# EAGLE design RF-Gen_Controller (EAGLE 4.16)

## Sheet 1 of 4
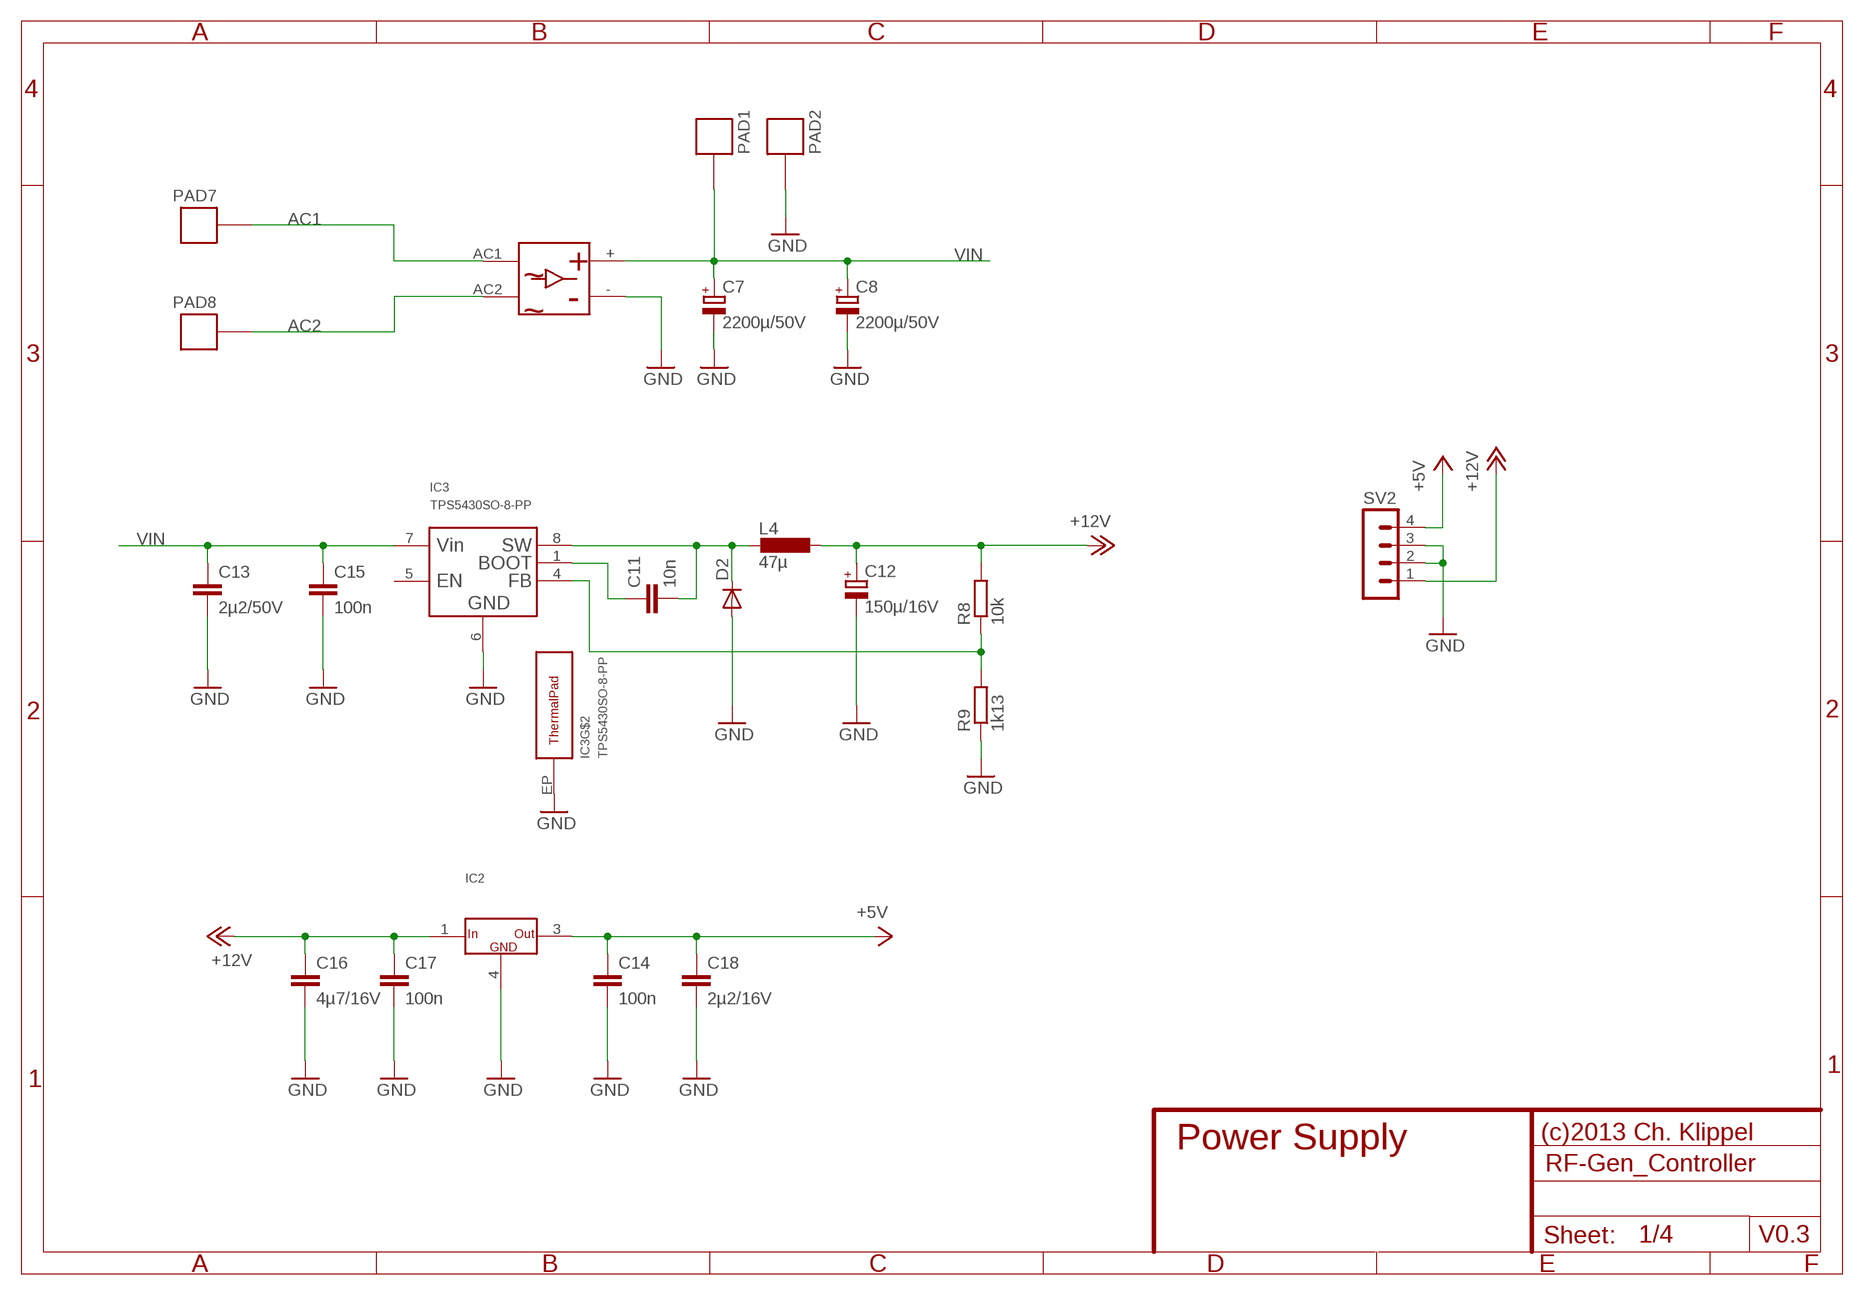
[diagram p0: schematic, sheet 1]

### Parts
BR1  RECTIFIERGBJ_THT  [GBJ_THT]
C7  2200µ/50V  C-POL-EU-EEUHD1H_VERT2  [CAP_EEUHD1H_VERT2]
C8  2200µ/50V  C-POL-EU-EEUHD1H_VERT2  [CAP_EEUHD1H_VERT2]
C11  10n  C-EU-1206  [C_1206_REFLOW]
C12  150µ/16V  C-POL-EU-AL_100_108  [CAP_AL_100_108]
C13  2µ2/50V  C-EU-1210  [C_1210_REFLOW]
C14  100n  C-EU-0805  [C_0805_REFLOW]
C15  100n  C-EU-0805  [C_0805_REFLOW]
C16  4µ7/16V  C-EU-1210  [C_1210_REFLOW]
C17  100n  C-EU-0805  [C_0805_REFLOW]
C18  2µ2/16V  C-EU-1210  [C_1210_REFLOW]
D2  DIODE-SMB  [SMB]
IC2  VREG_3DPAK-3  [DPAK-3]
IC3  TPS5430SO-8-PP  [SO-8-PP]
L4  47µ  L-EU-SSR1260  [SSR1260]
PAD1  SOLPAD5MM  [SOLPAD_5]
PAD2  SOLPAD5MM  [SOLPAD_5]
PAD7  SOLPAD5MM  [SOLPAD_5]
PAD8  SOLPAD5MM  [SOLPAD_5]
R8  10k  R-EU-0805  [R_0805_REFLOW]
R9  1k13  R-EU-0805  [R_0805_REFLOW]
SV2  MA04-1  [MA04-1]

### Nets
+5V: C14.P$1 C18.P$1 IC2.3(OUT) SV2.4 ; also sheet 2,3,4
+12V: C12.+ C16.P$1 C17.P$1 IC2.1(IN) L4.1 R8.P$2 SV2.1 ; also sheet 4
AC1: BR1.AC1 PAD7.P$1
AC2: BR1.AC2 PAD8.P$1
GND: BR1.- C7.- C8.- C12.- C13.P$2 C14.P$2 C15.P$2 C16.P$2 C17.P$2 C18.P$2 D2.A IC2.4(GND) IC3.6(GND) IC3.EP(THERMALPAD) PAD2.P$1 R9.P$1 SV2.2 SV2.3 ; also sheet 2,3,4
N$11: C11.P$1 IC3.1(BOOT)
N$13: IC3.4(FB) R8.P$1 R9.P$2
SW12: C11.P$2 D2.C IC3.8(SW) L4.2
VIN: BR1.+ C7.+ C8.+ C13.P$1 C15.P$1 IC3.7(VIN) PAD1.P$1 ; also sheet 4
Unconnected: IC3.5(EN)

### Notes on the sheet
- (c)2013 Ch. Klippel
- Power Supply
- V0.3

## Sheet 2 of 4
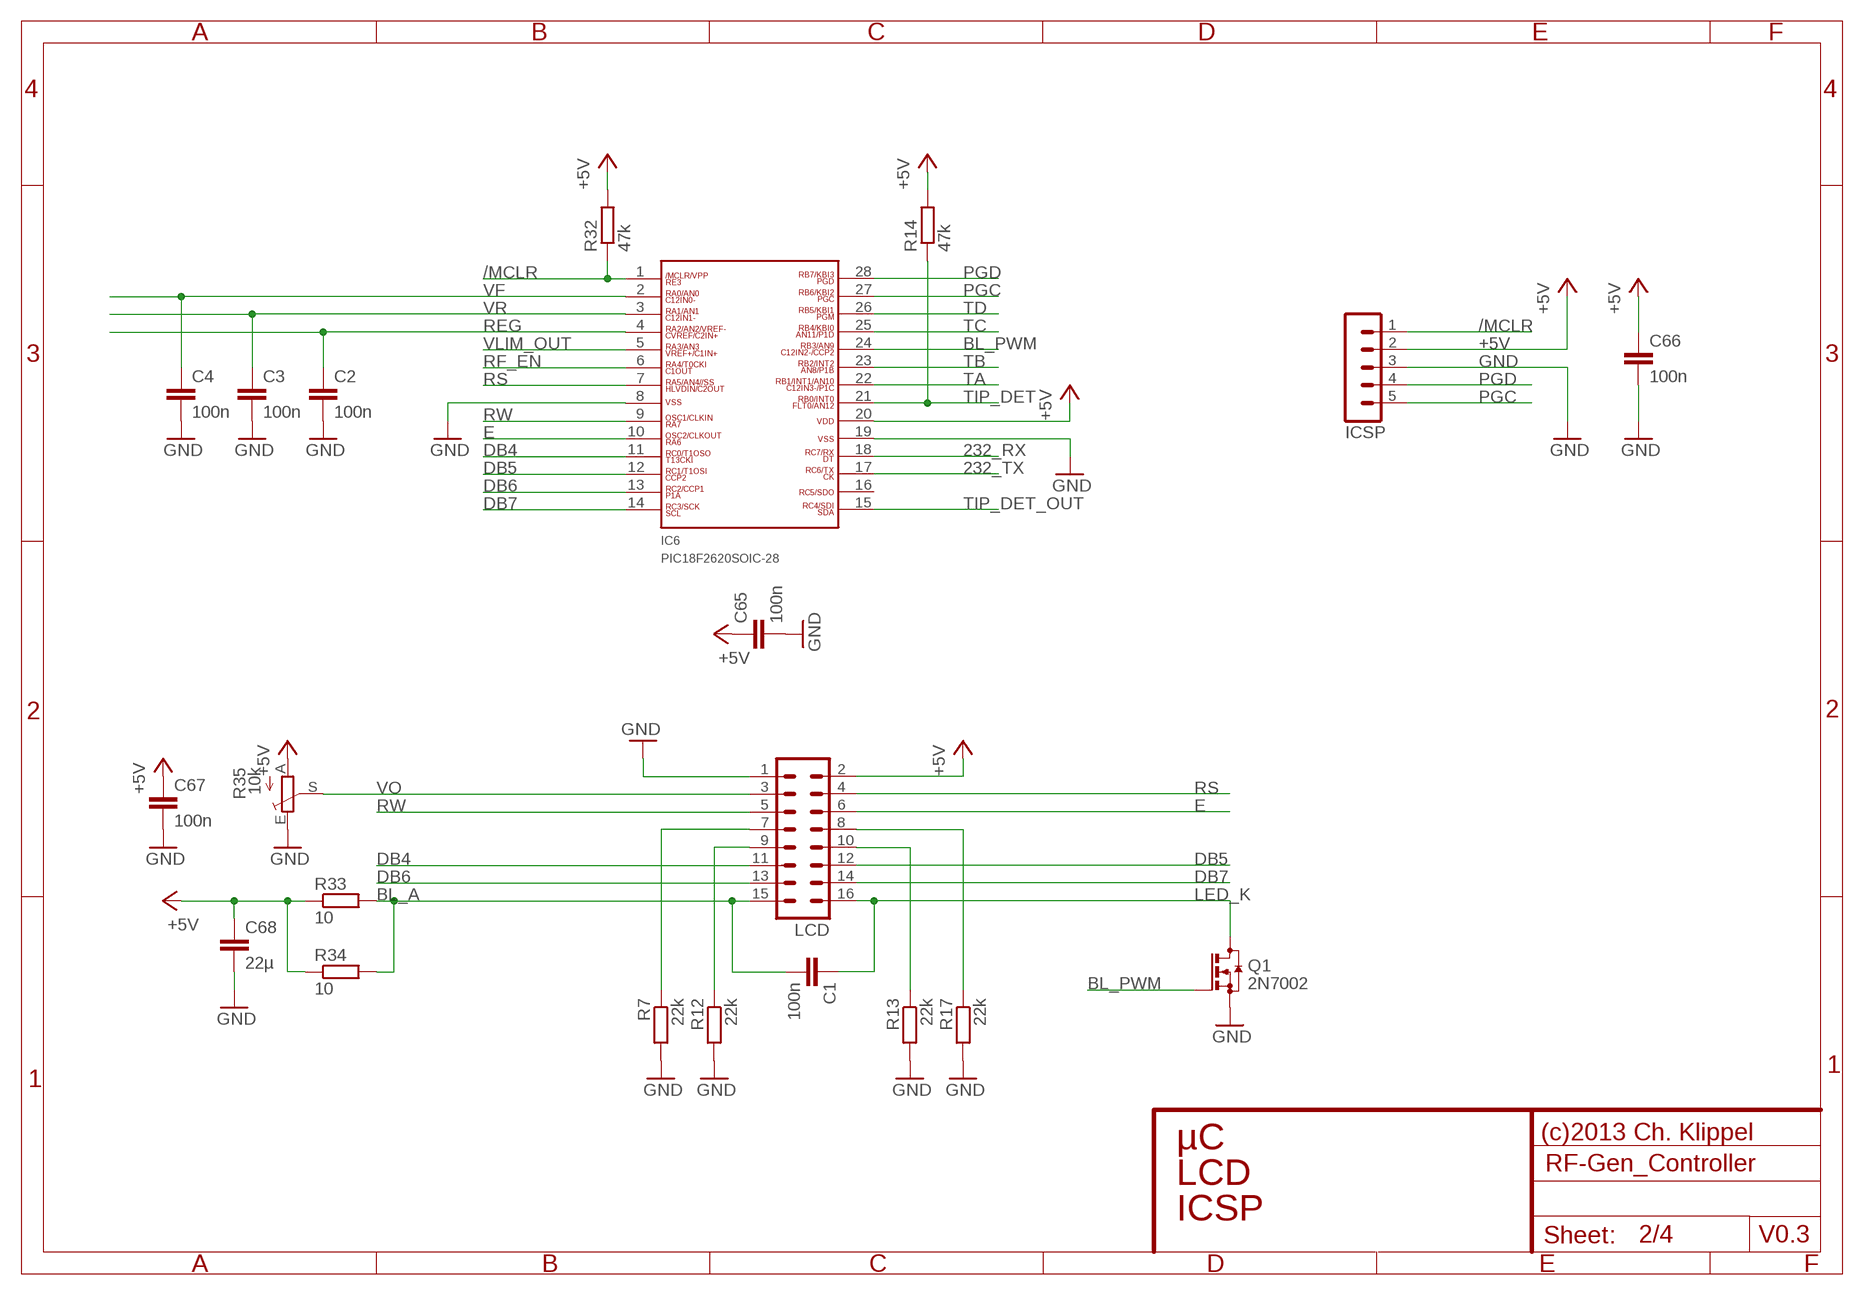
[diagram p1: schematic, sheet 2]

### Parts
C1  100n  C-EU-0805  [C_0805_REFLOW]
C2  100n  C-EU-0805  [C_0805_REFLOW]
C3  100n  C-EU-0805  [C_0805_REFLOW]
C4  100n  C-EU-0805  [C_0805_REFLOW]
C65  100n  C-EU-0805  [C_0805_REFLOW]
C66  100n  C-EU-0805  [C_0805_REFLOW]
C67  100n  C-EU-0805  [C_0805_REFLOW]
C68  22µ  C-EU-1206  [C_1206_REFLOW]
IC6  PIC18F2620SOIC-28  PIC18F26K20SOIC-28  [SOIC-28]
ICSP  MA05-1THT  [MA05-1]
LCD  ML16  [ML16]
Q1  2N7002  BSS123  [SOT23]
R7  22k  R-EU-0805  [R_0805_REFLOW]
R12  22k  R-EU-0805  [R_0805_REFLOW]
R13  22k  R-EU-0805  [R_0805_REFLOW]
R14  47k  R-EU-0805  [R_0805_REFLOW]
R17  22k  R-EU-0805  [R_0805_REFLOW]
R32  47k  R-EU-0805  [R_0805_REFLOW]
R33  10  R-EU-1206  [R_1206_REFLOW]
R34  10  R-EU-1206  [R_1206_REFLOW]
R35  10k  TRIM_EU-3364W  [3364W]

### Nets
232_RX: IC6.18 ; also sheet 3
232_TX: IC6.17 ; also sheet 3
+5V: C65.P$1 C66.P$1 C67.P$1 C68.P$1 IC6.20 ICSP.2 LCD.2 R14.P$2 R32.P$2 R33.P$1 R34.P$1 R35.A ; also sheet 1,3,4
/MCLR: IC6.1 ICSP.1 R32.P$1 ; also sheet 3
BL_A: C1.P$2 LCD.15 R33.P$2 R34.P$2
BL_PWM: IC6.24 Q1.1(G)
DB4: IC6.11 LCD.11
DB5: IC6.12 LCD.12
DB6: IC6.13 LCD.13
DB7: IC6.14 LCD.14
E: IC6.10 LCD.6
GND: C2.P$2 C3.P$2 C4.P$2 C65.P$2 C66.P$2 C67.P$2 C68.P$2 IC6.8 IC6.19 ICSP.3 LCD.1 Q1.2(S) R7.P$2 R12.P$2 R13.P$2 R17.P$2 R35.E ; also sheet 1,3,4
LED_K: C1.P$1 LCD.16 Q1.3(D)
N$3: LCD.9 R12.P$1
N$4: LCD.7 R7.P$1
N$5: LCD.10 R13.P$1
N$16: LCD.8 R17.P$1
PGC: IC6.27 ICSP.5
PGD: IC6.28 ICSP.4
REG: C2.P$1 IC6.4 ; also sheet 4
RF_EN: IC6.6 ; also sheet 4
RS: IC6.7 LCD.4
RW: IC6.9 LCD.5
TA: IC6.22 ; also sheet 3
TB: IC6.23 ; also sheet 3
TC: IC6.25 ; also sheet 3
TD: IC6.26 ; also sheet 3
TIP_DET: IC6.21 R14.P$1 ; also sheet 4
TIP_DET_OUT: IC6.15
VF: C4.P$1 IC6.2 ; also sheet 4
VLIM_OUT: IC6.5 ; also sheet 4
VO: LCD.3 R35.S
VR: C3.P$1 IC6.3 ; also sheet 4
Unconnected: IC6.16

### Notes on the sheet
- (c)2013 Ch. Klippel
- µC
- LCD
- ICSP
- V0.3

## Sheet 3 of 4
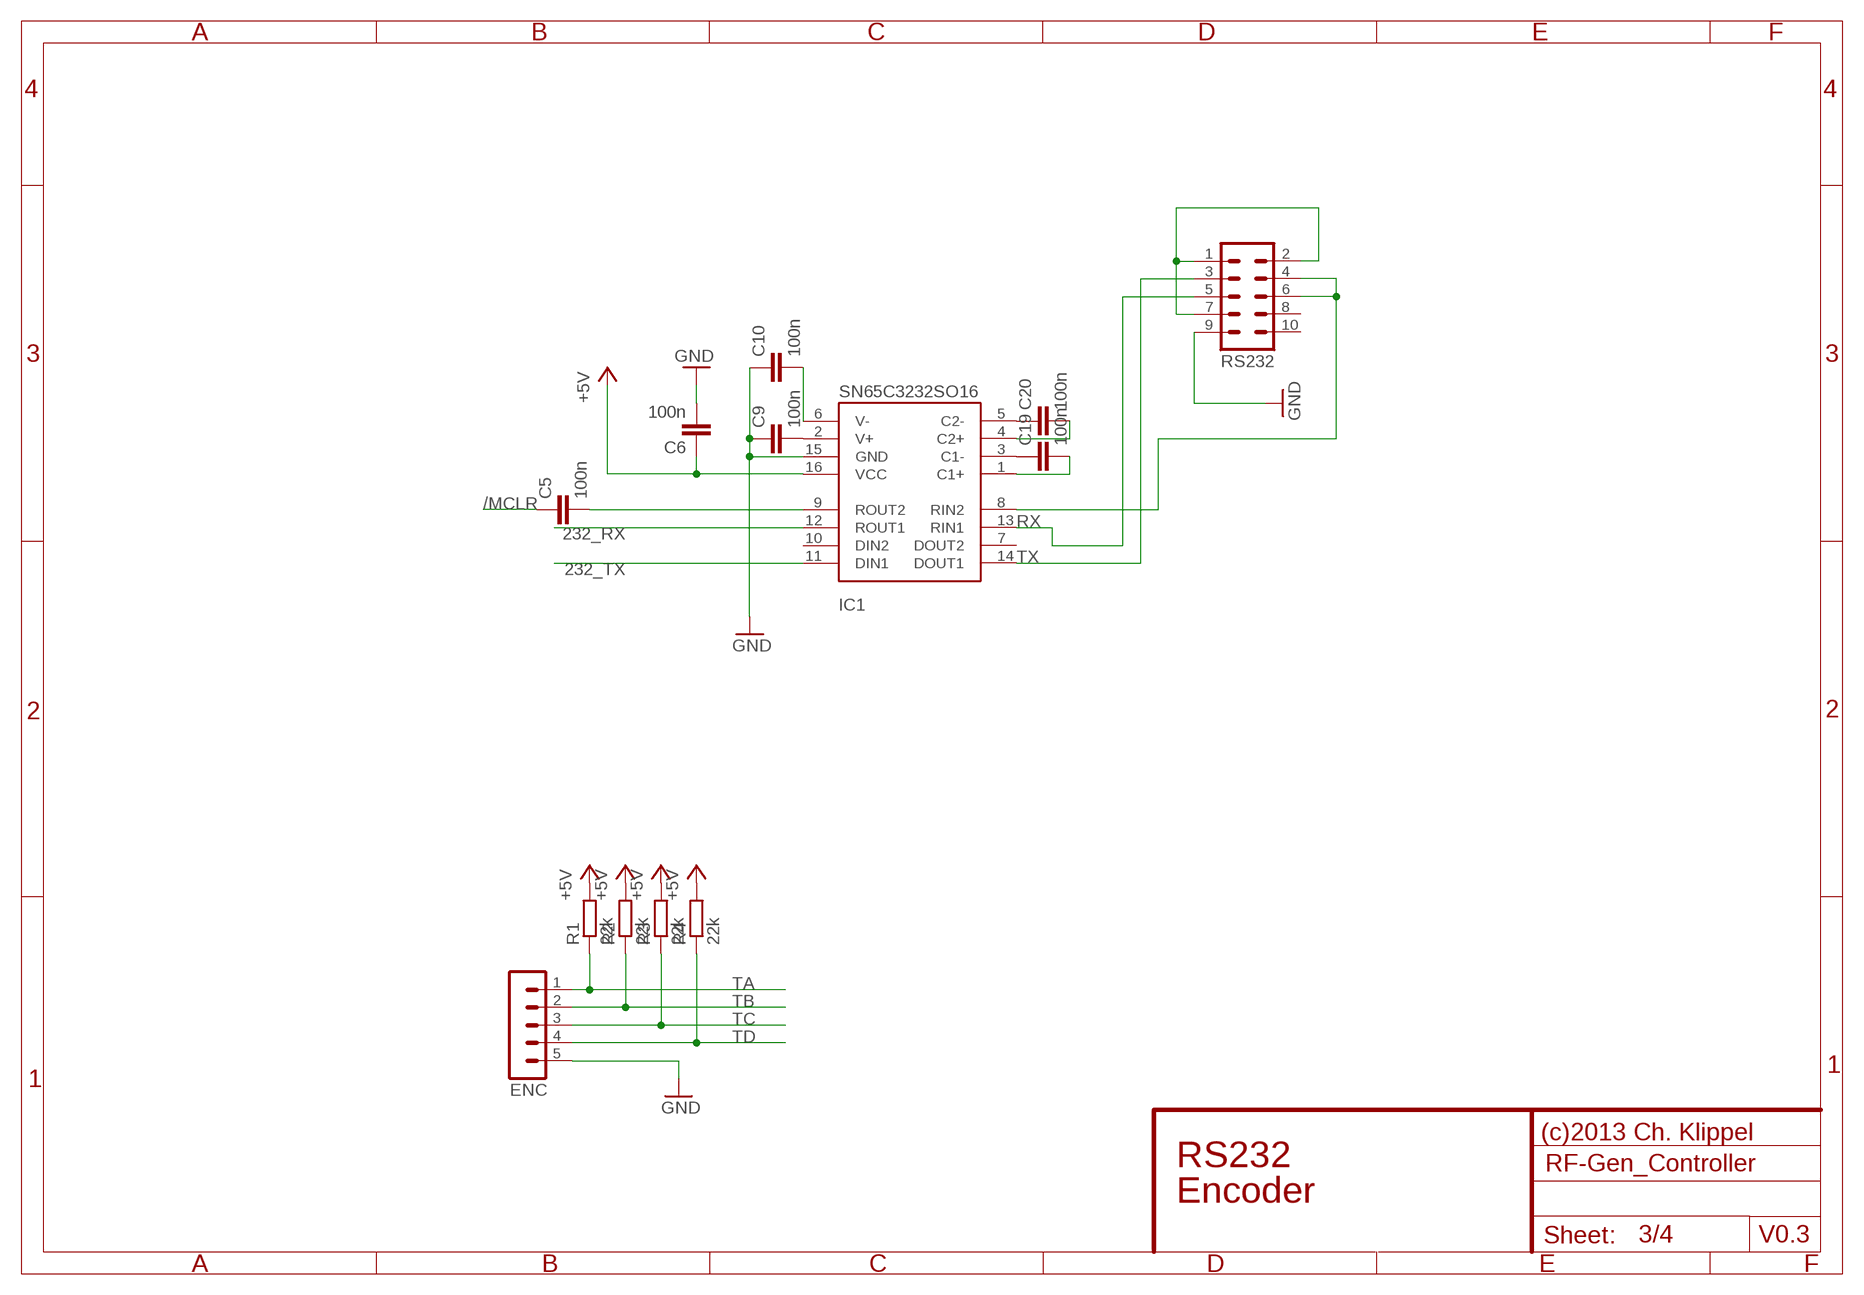
[diagram p2: schematic, sheet 3]

### Parts
C5  100n  C-EU-0805  [C_0805_REFLOW]
C6  100n  C-EU-0805  [C_0805_REFLOW]
C9  100n  C-EU-0805  [C_0805_REFLOW]
C10  100n  C-EU-0805  [C_0805_REFLOW]
C19  100n  C-EU-0805  [C_0805_REFLOW]
C20  100n  C-EU-0805  [C_0805_REFLOW]
ENC  MA05-1THT  [MA05-1]
IC1  SN65C3232SO16  [SO16]
R1  22k  R-EU-0805  [R_0805_REFLOW]
R2  22k  R-EU-0805  [R_0805_REFLOW]
R3  22k  R-EU-0805  [R_0805_REFLOW]
R4  22k  R-EU-0805  [R_0805_REFLOW]
RS232  ML10  [ML10]

### Nets
232_RX: IC1.12(ROUT1) ; also sheet 2
232_TX: IC1.11(DIN1) ; also sheet 2
+5V: C6.P$1 IC1.16(VCC) R1.P$2 R2.P$2 R3.P$2 R4.P$2 ; also sheet 1,2,4
/MCLR: C5.P$1 ; also sheet 2
DETECT: RS232.1 RS232.2 RS232.7
GND: C6.P$2 C9.P$1 C10.P$1 ENC.5 IC1.15(GND) RS232.9 ; also sheet 1,2,4
N$6: C9.P$2 IC1.2(V+)
N$8: C5.P$2 IC1.9(ROUT2)
N$9: C10.P$2 IC1.6(V-)
N$14: C19.P$1 IC1.3(C1-)
N$15: C20.P$1 IC1.5(C2-)
N$20: C20.P$2 IC1.4(C2+)
N$21: C19.P$2 IC1.1(C1+)
RX: IC1.13(RIN1) RS232.5
SRESET: IC1.8(RIN2) RS232.4 RS232.6
TA: ENC.1 R1.P$1 ; also sheet 2
TB: ENC.2 R2.P$1 ; also sheet 2
TC: ENC.3 R3.P$1 ; also sheet 2
TD: ENC.4 R4.P$1 ; also sheet 2
TX: IC1.14(DOUT1) RS232.3
Unconnected: IC1.7(DOUT2) IC1.10(DIN2) RS232.8 RS232.10

### Notes on the sheet
- (c)2013 Ch. Klippel
- RS232
- Encoder
- V0.3

## Sheet 4 of 4
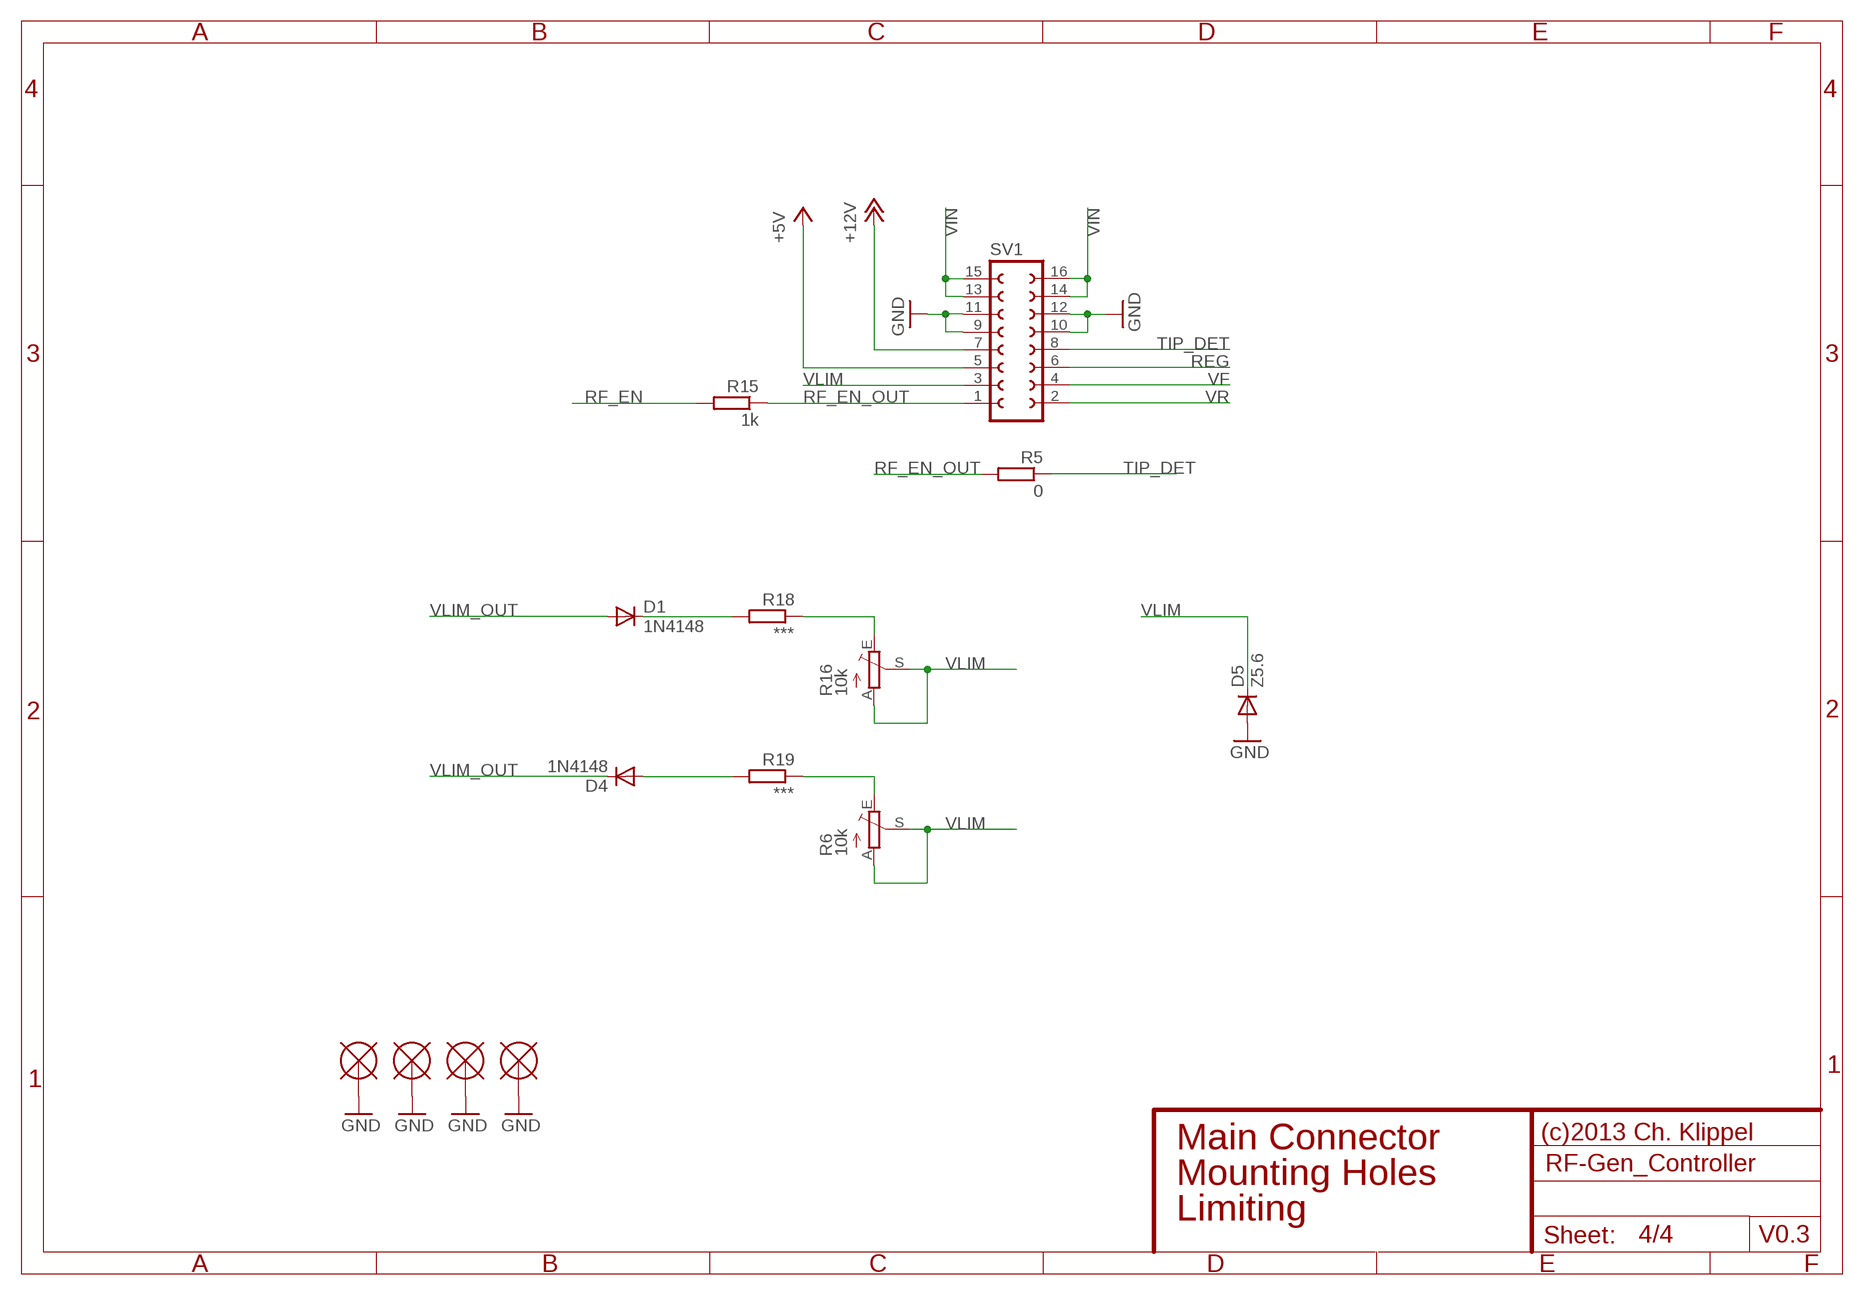
[diagram p3: schematic, sheet 4]

### Parts
D1  1N4148  DIODE-LL-34  [LL-34]
D4  1N4148  DIODE-LL-34  [LL-34]
D5  Z5.6  DIODE-LL-34  [LL-34]
R5  0  R-EU-0805  [R_0805_REFLOW]
R6  10k  TRIM_EU-3364W  [3364W]
R15  1k  R-EU-0805  [R_0805_REFLOW]
R16  10k  TRIM_EU-3364W  [3364W]
R18  ***  R-EU-0805  [R_0805_REFLOW]
R19  ***  R-EU-0805  [R_0805_REFLOW]
SV1  FE08-2  [FE08-2]
U$6  MOUNTPADM3_WASHER  [PAD_M3_WASHER]
U$7  MOUNTPADM3_WASHER  [PAD_M3_WASHER]
U$8  MOUNTPADM3_WASHER  [PAD_M3_WASHER]
U$9  MOUNTPADM3_WASHER  [PAD_M3_WASHER]

### Nets
+5V: SV1.5 ; also sheet 1,2,3
+12V: SV1.7 ; also sheet 1
GND: D5.A SV1.9 SV1.10 SV1.11 SV1.12 U$6.P$1 U$7.P$1 U$8.P$1 U$9.P$1 ; also sheet 1,2,3
N$1: R6.E R19.P$1
N$2: R16.E R18.P$1
N$17: D1.C R18.P$2
N$19: D4.A R19.P$2
REG: SV1.6 ; also sheet 2
RF_EN: R15.P$2 ; also sheet 2
RF_EN_OUT: R5.P$2 R15.P$1 SV1.1
TIP_DET: R5.P$1 SV1.8 ; also sheet 2
VF: SV1.4 ; also sheet 2
VIN: SV1.13 SV1.14 SV1.15 SV1.16 ; also sheet 1
VLIM: D5.C R6.A R6.S R16.A R16.S SV1.3
VLIM_OUT: D1.A D4.C ; also sheet 2
VR: SV1.2 ; also sheet 2

### Notes on the sheet
- (c)2013 Ch. Klippel
- Main Connector
- Mounting Holes
- Limiting
- V0.3

## Library data of the parts
BR1 = parts:RECTIFIER
C1-C6 C9-C11 C13-C20 C65-C68 = parts:C-EU-
C7 C8 C12 = parts:C-POL-EU-
D1 D2 D4 D5 = parts:DIODE-: RECTIFIER DIODES
ENC ICSP = parts:MA05-1: PIN HEADER
IC1 = bauteile:SN65C3232
IC2 = parts:VREG_3
IC3 = parts:TPS5430
IC6 = parts:PIC18F26K20
L4 = parts:L-EU-
LCD = con-harting-ml:ML16: HARTING
PAD1 PAD2 PAD7 PAD8 = parts:SOLPAD
Q1 = parts:BSS123: N-CHANNEL MOS FET
R1-R5 R7-R9 R12-R15 R17-R19 R32-R34 = parts:R-EU-
R6 R16 R35 = parts:TRIM_EU-: POTENTIOMETER
RS232 = con-harting-ml:ML10: HARTING
SV1 = con-lsta:FE08-2: FEMALE HEADER
SV2 = con-lstb:MA04-1: PIN HEADER
U$6-U$9 = parts:MOUNTPAD

## Board
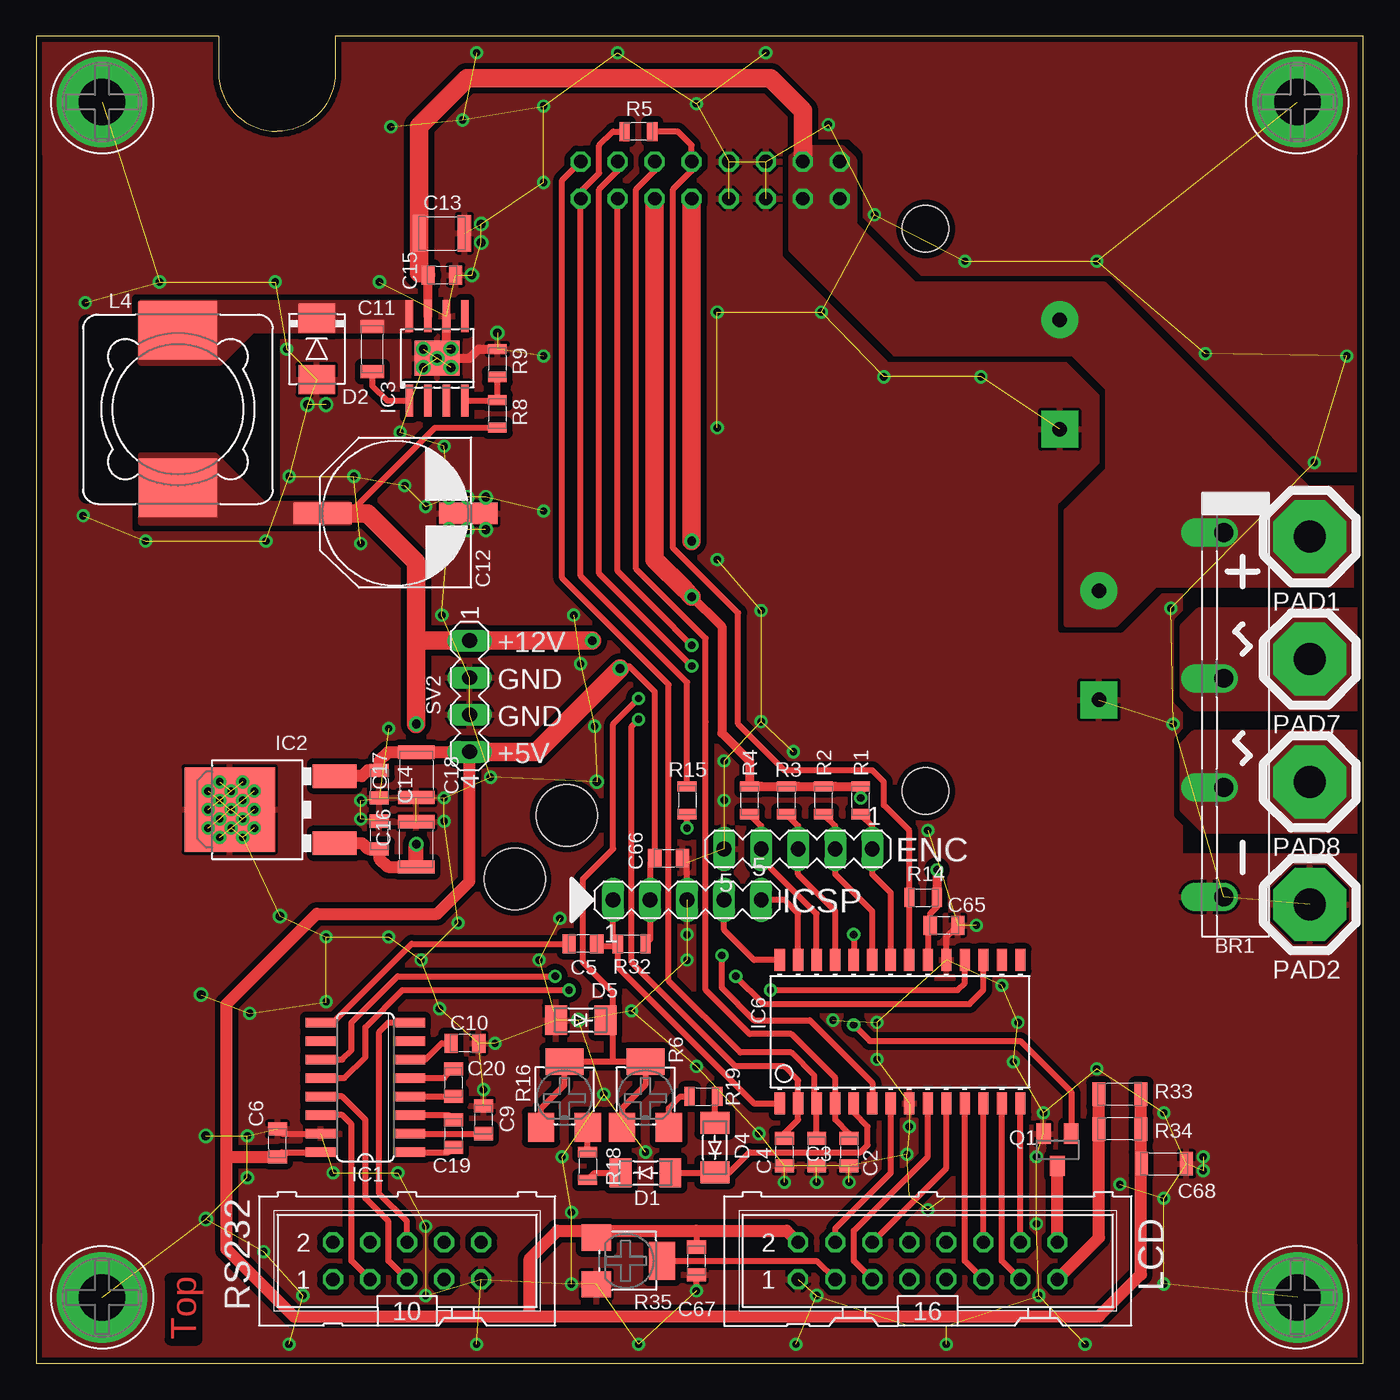
[diagram p4: board, top side]
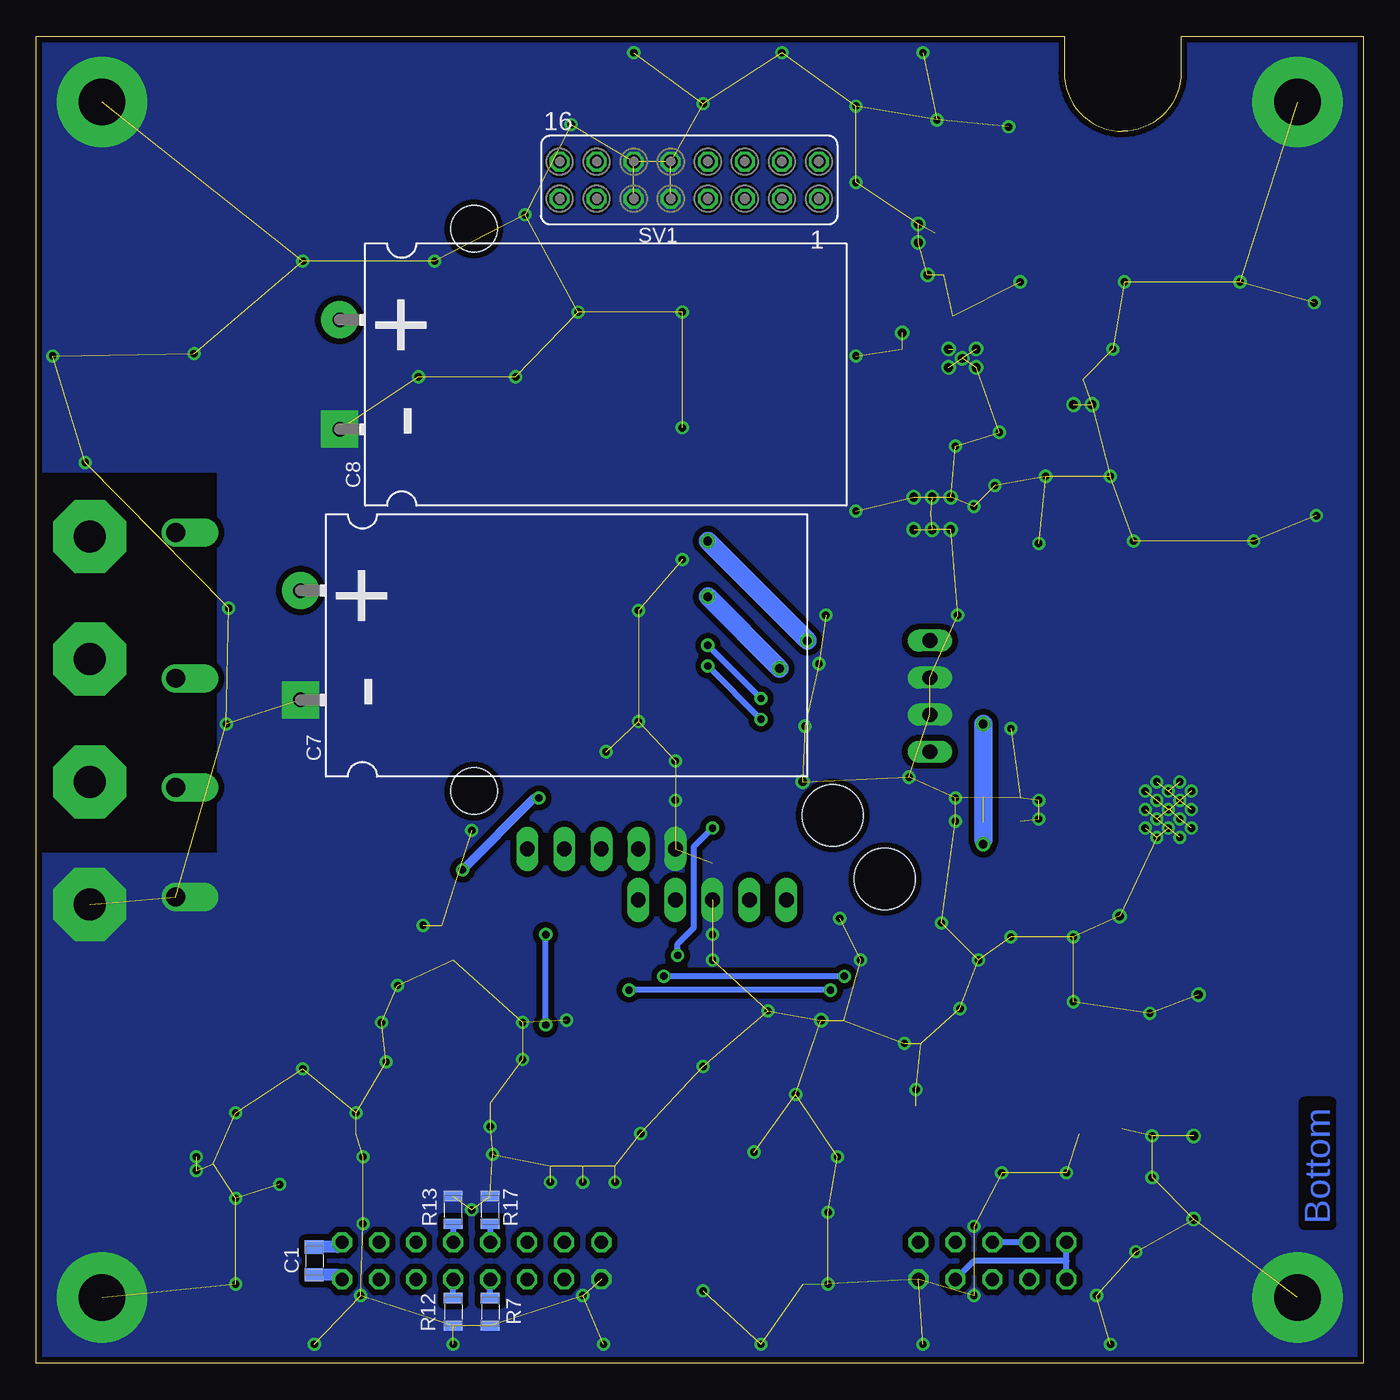
[diagram p5: board, bottom side, seen from below]

Size 91 x 91 mm. Coordinates in mm from the lower left corner, seen from the top.
Outline: 0,0 91,0 91,91 20.5,91 20.5,88.5 arc-90 16.5,84.5 arc-90 12.5,88.5 12.5,91 0,91 0,0
Copper layers (1*16): Top 0.035mm / dielectric 1.5mm / Bottom 0.035mm
Design rules "pcb-devboards": minimum track width 0.2mm, minimum drill 0.4mm, track to track 0.2mm, track to pad 0.2mm, pad to pad 0.2mm, via to via 0.2mm, smd to smd 0mil, copper to edge 0.4mm, drill to drill 0.2mm, minimum pad ring 0.2mm, minimum via ring 0.2mm, stop-mask expansion 0.1mm, vias tented up to drill 0.6mm, thermal gap 0.2mm
Holes 4.2 mm at 32.81,33.2 36.38,37.57
Holes 3.2 mm at 60.98,77.81 60.98,39.24
tRestrict: area 3.5,59.6 to 16.1,71.3

### Footprints (pad centres in the part's own frame; a part is rotated, then mirrored left to right if it is on the bottom)
GBJ_THT = drill 1.3 offset: + -12.5,-0.8; - 12.5,-0.8; AC1 -2.5,-0.8; AC2 5,-0.8
C_0805_REFLOW = smd 0.9 x 1.3: P$1 -0.95,0; P$2 0.95,0
CAP_EEUHD1H_VERT2 = drill 1 pad 2.54 round: + -3.75,0 | drill 1 pad 2.54 square: - 3.75,0
C_1206_REFLOW = smd 0.9 x 1.6: P$1 -1.55,0; P$2 1.55,0
CAP_AL_100_108 = smd 4 x 1.5: + -5,0; - 5,0
C_1210_REFLOW = smd 0.9 x 2.5: P$1 -1.55,0; P$2 1.55,0
LL-34 = smd 1.5 x 2: A 1.7,0; C -1.7,0
SMB = smd 2 x 2.5: A 2.1,0; C -2.1,0
MA05-1 = drill 1.016 long: 1 -5.08,0; 2 -2.54,0; 3 0,0; 4 2.54,0; 5 5.08,0
SO16 = smd 0.66 x 2.032: 1 -4.445,-3.073; 2 -3.175,-3.073; 3 -1.905,-3.073; 4 -0.635,-3.073; 5 0.635,-3.073; 6 1.905,-3.073; 7 3.175,-3.073; 8 4.445,-3.073; 9 4.445,3.073; 10 3.175,3.073; 11 1.905,3.073; 12 0.635,3.073; 13 -0.635,3.073; 14 -1.905,3.073; 15 -3.175,3.073; 16 -4.445,3.073
DPAK-3 = smd 1.6 x 3: 1 -2.3,-4.4; 3 2.3,-4.4 | smd 5.8 x 6.2: 4 0,2.8
SO-8-PP = smd 0.5 x 2.2: 1 -1.905,-2.9; 2 -0.635,-2.9; 3 0.635,-2.9; 4 1.905,-2.9; 5 1.905,2.9; 6 0.635,2.9; 7 -0.635,2.9; 8 -1.905,2.9 | smd 3.1 x 2.4: EP 0,0
SOIC-28 = smd 0.7 x 1.5: 1 -8.255,-4.921; 2 -6.985,-4.921; 3 -5.715,-4.921; 4 -4.445,-4.921; 5 -3.175,-4.921; 6 -1.905,-4.921; 7 -0.635,-4.921; 8 0.635,-4.921; 9 1.905,-4.921; 10 3.175,-4.921; 11 4.445,-4.921; 12 5.715,-4.921; 13 6.985,-4.921; 14 8.255,-4.921; 15 8.255,4.921; 16 6.985,4.921; 17 5.715,4.921; 18 4.445,4.921; 19 3.175,4.921; 20 1.905,4.921; 21 0.635,4.921; 22 -0.635,4.921; 23 -1.905,4.921; 24 -3.175,4.921; 25 -4.445,4.921; 26 -5.715,4.921; 27 -6.985,4.921; 28 -8.255,4.921
SSR1260 = smd 4 x 5.4: 1 -5.4,0; 2 5.4,0
ML16 = drill 0.914 octagon: 1 -8.89,-1.27; 2 -8.89,1.27; 3 -6.35,-1.27; 4 -6.35,1.27; 5 -3.81,-1.27; 6 -3.81,1.27; 7 -1.27,-1.27; 8 -1.27,1.27; 9 1.27,-1.27; 10 1.27,1.27; 11 3.81,-1.27; 12 3.81,1.27; 13 6.35,-1.27; 14 6.35,1.27; 15 8.89,-1.27; 16 8.89,1.27
SOLPAD_5 = drill 2.2 pad 5 octagon: P$1 0,0
SOT23 = smd 1 x 1.4: 1 -0.95,-1.1; 2 0.95,-1.1; 3 0,1.1
R_0805_REFLOW = smd 0.7 x 1.3: P$1 -0.95,0; P$2 0.95,0
3364W = smd 1.8 x 2: A -1.6,-2.1; E 1.6,-2.1 | smd 2.6 x 1.8: S 0,2.4
R_1206_REFLOW = smd 0.9 x 1.6: P$1 -1.45,0; P$2 1.45,0
ML10 = drill 0.914 octagon: 1 -5.08,-1.27; 2 -5.08,1.27; 3 -2.54,-1.27; 4 -2.54,1.27; 5 0,-1.27; 6 0,1.27; 7 2.54,-1.27; 8 2.54,1.27; 9 5.08,-1.27; 10 5.08,1.27
FE08-2 = drill 0.914 octagon: 1 -8.89,1.27; 2 -8.89,-1.27; 3 -6.35,1.27; 4 -6.35,-1.27; 5 -3.81,1.27; 6 -3.81,-1.27; 7 -1.27,1.27; 8 -1.27,-1.27; 9 1.27,1.27; 10 1.27,-1.27; 11 3.81,1.27; 12 3.81,-1.27; 13 6.35,1.27; 14 6.35,-1.27; 15 8.89,1.27; 16 8.89,-1.27
MA04-1 = drill 1.016 long: 1 -3.81,0; 2 -1.27,0; 3 1.27,0; 4 3.81,0
PAD_M3_WASHER = drill 3.2 pad 6.2 round: P$1 0,0

### Placement (x,y rotation side)
BR1  82.26,44.47 270 top
C1  71.94,7.01 270 bottom
C2  55.74,14.47 270 top
C3  53.52,14.47 270 top
C4  51.3,14.47 270 top
C5  37.49,28.76 180 top
C6  16.53,15.11 90 top
C7  72.89,49.24 270 bottom
C8  70.19,67.81 270 bottom
C9  30.66,16.69 270 top
C10  29.39,21.93 180 top
C11  23.04,69.56 90 top
C12  24.63,58.29 0 top
C13  27.8,77.49 0 top
C14  23.52,39.71 270 top
C15  27.8,74.64 0 top
C16  26.06,35.58 90 top
C17  23.52,36.22 90 top
C18  26.06,40.35 270 top
C19  28.6,15.74 270 top
C20  28.6,19.23 270 top
C65  62.25,30.03 0 top
C66  43.36,34.63 0 top
C67  45.27,7.01 270 top
C68  77.33,13.68 0 top
D1  41.77,13.04 0 top
D2  19.23,69.56 270 top
D4  46.54,14.79 90 top
D5  37.33,23.52 180 top
ENC  52.25,35.27 180 top
IC1  22.57,18.91 90 top
IC2  16.06,37.96 90 top
IC3  27.49,68.92 0 top
IC6  59.24,22.73 0 top
ICSP  44.63,31.77 0 top
L4  9.71,65.43 90 top
LCD  61.14,7.01 0 top
PAD1  87.34,56.7 0 top
PAD2  87.34,31.46 0 top
PAD7  87.34,48.28 0 top
PAD8  87.34,39.87 0 top
Q1  70.03,14.63 180 top
R1  56.54,38.6 90 top
R2  54,38.6 90 top
R3  51.46,38.6 90 top
R4  48.92,38.6 90 top
R5  41.3,84.48 180 top
R6  41.78,18.28 0 top
R7  59.87,3.52 270 bottom
R8  31.61,65.11 270 top
R9  31.61,68.6 270 top
R12  62.41,3.52 270 bottom
R13  62.41,10.5 90 bottom
R14  60.83,31.93 0 top
R15  44.63,38.6 270 top
R16  36.22,18.28 0 top
R17  59.87,10.5 90 bottom
R18  37.81,13.52 270 top
R19  45.74,18.28 0 top
R32  40.82,28.76 0 top
R33  74.32,18.44 180 top
R34  74.32,16.06 180 top
R35  40.51,7.01 270 top
RS232  25.42,7.01 0 top
SV1  46.22,81.14 180 bottom
SV2  29.71,45.74 270 top
U$6  86.5,86.5 0 top
U$7  86.5,4.5 0 top
U$8  4.5,86.5 0 top
U$9  4.5,4.5 0 top

### Tracks (layer width: path | path; a pad name or v marks a point on that pad's centre or on a via)
232_RX  (via drill 0.5)
  Top 0.406: IC6.18 63.68,26.06 63.21,25.58 v50.35,25.58 | v36.54,25.58 25.11,25.58 22.57,23.04 22.57,20.98 21.14,19.55 IC1.12
  Bottom 0.406: v36.54,25.58 v50.35,25.58
232_TX  (via drill 0.5)
  Top 0.406: IC6.17 64.95,25.58 64,24.63 49.87,24.63 v47.97,26.54 | v35.58,26.54 24.79,26.54 21.61,23.36 21.61,21.45 20.98,20.82 IC1.11
  Bottom 0.406: v35.58,26.54 v47.97,26.54
+5V  (via drill 0.5 pad 0.81, 0.6 pad 1.02)
  Top 0.406: R32.P$2 42.09,29.07 ICSP.2 42.09,34.31 C66.P$1 | C6.P$1 | C6.P$1 | IC1.16 16.85,14.47 C6.P$1 | C66.P$1 | C66.P$1 42.41,46.06 40.66,47.81 40.03,47.81 v40.03,47.65 | 45.27,9.07 C67.P$1 | R35.A 38.41,9.04 38.44,9.07 | IC6.20 61.14,29.87 C65.P$1 61.3,30.82 61.78,31.3 61.78,31.77 61.77,31.77 R14.P$2
  Top 0.61: v44.95,52.57 44.79,52.73 47.01,50.51 47.01,43.2 48.92,41.3 R4.P$2 49.71,39.55 49.72,39.55 R3.P$2 52.25,39.55 52.26,39.55 R2.P$2 54.79,39.55 54.8,39.55 R1.P$2 56.54,39.08 | R14.P$2 | R14.P$2 | v61.78,33.84 R14.P$2 | 56.54,39.08 | 56.54,39.08 v56.54,38.76
  Top 0.813: 13.04,14.15 13.04,7.8 17.64,3.2 33.84,3.2 | LCD.2 51.46,9.07 45.27,9.07 38.44,9.07 35.74,9.07 33.84,7.17 33.84,3.2 | 13.04,14.15 C6.P$1 | IC2.3 22.33,40.27 22.72,40.66 C14.P$1 23.52,41.3 24.12,41.9 C18.P$1 29.67,41.9 SV2.4 29.71,41.77 | 13.04,14.15 13.04,24.63 19.23,30.82 27.49,30.82 29.71,33.04 29.71,41.77 | 29.71,41.77 | 33.84,3.2 72.89,3.2 75.77,6.08 75.77,13.65 75.75,13.68 | R33.P$1 75.77,16.24 75.75,16.22 75.77,16.22 R34.P$1 75.77,13.7 75.75,13.68 | 75.75,13.68 | 75.75,13.68 C68.P$1
  Top 1.27: v44.95,52.57 44.47,53.05 42.41,55.11 SV1.5 | v40.03,47.65 34.31,41.93 SV2.4
  Bottom 0.61: 56.86,38.76 v61.78,33.84 | 56.86,38.76 | v56.54,38.76 56.86,38.76
  Bottom 1.27: v40.03,47.65 v44.95,52.57
+12V  (via drill 0.6 pad 0.81, 0.6 pad 1.02)
  Top 0.406: R8.P$2 27.33,64.16 21.45,58.28 19.71,58.28 | 19.71,58.28 | 19.71,58.28 C12.+
  Top 0.813: IC2.1 22.33,35.66 22.72,35.27 C17.P$1 23.52,34.63 24.12,34.03 C16.P$1 26.06,34.31 | 26.06,34.31
  Top 1.016: 26.06,34.31 v26.06,35.58
  Top 1.27: 19.55,58.28 | 19.55,58.28 C12.+ | 19.55,58.28 21.45,58.28 22.73,58.28 26.06,54.95 26.06,49.55 | v44.95,56.38 SV1.7 | SV2.1 | v38.12,49.55 37.97,49.55 SV2.1 | v26.06,43.84 26.06,49.55 | 26.06,49.55 SV2.1
  Bottom 1.016: v26.06,35.58 26.06,35.9
  Bottom 1.27: v38.12,49.55 v44.95,56.38 | 26.06,35.9 v26.06,43.84
  pour Top (rank 3, no thermals): 7.17,62.25 7.17,57.65 21.45,57.65 21.45,58.92 15.58,58.92 12.25,62.25
/MCLR
  Top 0.406: R32.P$1 39.55,29.07 ICSP.1 | IC6.1 49.24,17.8 39.87,27.17 39.87,28.44 R32.P$1 | 39.71,28.6 | 39.71,28.6 R32.P$1 | C5.P$1 38.44,28.6 39.71,28.6 | 39.71,28.6
AC1
  pour Top (no thermals): 90.99,51.62 79.72,51.62 78.61,50.51 78.61,45.74 79.4,44.95 90.99,44.95
AC2
  pour Top (no thermals): 90.99,43.2 79.4,43.2 78.61,42.41 78.61,37.97 80.03,36.54 90.99,36.54
BL_A
  Top 0.813: LCD.15 72.87,8.57 72.87,8.6 72.89,8.6 72.87,8.62 R34.P$2 72.87,16.22 72.89,16.22 72.87,16.24 R33.P$2
  Bottom 0.813: C1.P$2 70.35,6.06 LCD.15
BL_PWM  (via drill 0.5)
  Top 0.406: Q1.1 70.98,18.6 67.49,22.09 57.17,22.09 v56.06,23.2 | IC6.24 | v56.06,29.39 IC6.24
  Bottom 0.406: v56.06,23.2 v56.06,29.39
DB4
  Top 0.406: IC6.11 63.68,7.01 LCD.11
DB5
  Top 0.406: LCD.12 IC6.12
DB6
  Top 0.406: IC6.13 66.22,7.01 LCD.13
DB7
  Top 0.406: LCD.14 IC6.14
DETECT
  Bottom 0.406: RS232.1 | RS232.1 | RS232.1 20.34,7.01 | 20.34,7.01 RS232.2 | RS232.1 | RS232.7 26.69,7.01 20.34,7.01
E
  Top 0.406: IC6.10 62.41,13.36 LCD.6
GND  (via drill 0.5, 0.6)  (199 unrouted)
  Top 0.406: C6.P$2 | C6.P$2 | IC1.15 16.85,15.74 C6.P$2 | C66.P$2 | C66.P$2 | ICSP.3 44.63,34.31 C66.P$2 | v45.27,4.95 | v45.27,4.95 C67.P$2 | C65.P$2 62.41,29.23 IC6.19
  Top 0.61: IC3.6 28.12,69.56 IC3.EP | R9.P$1 30.34,69.55 29.71,68.92 IC3.EP | IC3.EP | C15.P$2 | C15.P$2
  other vias: 27.49,68.92 18.6,65.75 19.87,65.75 28.44,68.29 28.44,69.56 26.54,69.56 26.54,68.29 31.61,70.67 29.87,74.64 30.5,76.86 30.5,78.13 29.55,57.17 30.82,57.17 28.28,57.17 28.28,59.4 29.55,59.4 30.82,59.4 30.66,18.76 31.46,21.93 51.3,12.41 53.52,12.41 55.74,12.41 69.08,17.17 59.87,16.22 14.15,36.06 80.03,13.2 14.15,38.6 13.36,36.7 13.36,37.97 14.15,37.33 13.36,39.23 57.65,23.36 54.63,23.52 57.65,20.82 67.02,20.66 66.22,25.9 67.33,23.36 72.73,20.19 80.03,14.15 74.32,12.25 68.6,9.55 68.6,14.15 59.71,14.31 53.52,4.63 68.76,4.63 36.69,5.42 36.69,10.34 26.69,4.63 26.69,9.39 24.79,13.04 20.34,13.04 14.47,12.72 15.58,7.64 18.28,4.63 14.47,15.58 27.65,24.31 34.47,27.65 35.9,30.5 44.63,27.65 44.63,29.39 49.55,15.74 37.17,23.52 38.44,39.87 17.33,60.83 24.95,63.84 21.77,60.83 7.48,56.38 22.25,56.22 15.74,56.38 25.26,60.19 27.96,62.89 11.61,15.58 11.61,9.87 17.17,69.56 26.69,58.76 3.2,58.13 14.15,39.87 40.82,24.15 38.92,18.44 41.77,14.47 36.06,14.15 45.27,20.34 17.33,1.29 30.19,1.29 41.3,1.29 52.09,1.29 62.41,1.29 71.94,1.29 61.14,10.5 12.56,38.6 12.56,37.33 12.56,39.87 12.56,36.06 14.95,36.7 14.95,37.97 14.95,39.24 11.77,39.24 11.77,37.97 11.77,36.7 27.96,38.76 27.96,37.17 22.25,37.33 22.25,38.6 24.15,43.52 37.33,47.97 38.28,43.68 31.14,40.19 28.92,30.19 24.15,29.23 19.87,29.23 14.63,24 19.87,24.79 64.48,30.03 61.14,36.54 51.94,41.93 49.71,44 49.71,51.62 46.7,55.11 46.7,64.16 46.7,72.1 53.84,72.1 58.13,67.65 64.79,67.65 77.81,51.78 77.97,43.84 26.38,27.65 3.36,72.73 8.44,74.16 23.52,74.16 24.31,84.8 30.19,89.88 39.87,89.88 50.03,89.88 54.32,84.96 29.23,85.27 34.79,86.23 45.27,86.38 57.49,78.76 63.68,75.59 72.73,75.59 80.19,69.24 87.65,61.78 89.88,69.08 34.79,80.99 34.79,69.08 34.79,58.44 36.85,51.3 27.8,51.3 47.17,38.6 47.17,41.3 77.33,5.42 77.33,11.3 77.33,17.17 16.37,74.16 11.29,25.27 16.69,30.66
  pour Top (rank 4, no thermals): 0.18,90.83 7.96,90.83 7.96,83.05 0.18,83.05
  pour Top (isolate 0.356, rank 4, no thermals): -0.14,7.96 7.96,7.96 7.96,-0.13 -0.14,-0.13
  pour Top (isolate 0.356, rank 4, no thermals): 83.05,7.96 90.83,7.96 90.83,-0.13 83.05,-0.13
  pour Top (isolate 0.356, rank 4, no thermals): 83.05,90.83 90.83,90.83 90.83,83.05 83.05,83.05
  pour Bottom (isolate 0.406, rank 4, no thermals): 0.02,0.02 0.02,90.99 90.99,90.99 90.99,61.3 78.45,61.3 78.45,34.79 90.99,34.79 90.99,0.02
  pour Top (isolate 0.406, rank 5): 0.02,0.02 0.02,90.99 90.99,90.99 90.99,61.3 78.45,61.3 78.45,34.79 90.99,34.79 90.99,0.02
LED_K
  Top 0.813: LCD.16 Q1.3
  Bottom 0.813: C1.P$1 70.35,7.96 LCD.16
N$1
  Top 0.406: R19.P$1 44.16,18.28 43.38,17.5 R6.E
N$2
  Top 0.406: 37.81,16.22 37.82,16.22 R16.E | R18.P$1 37.81,16.22 | 37.81,16.22
N$3
  Bottom 0.406: R12.P$1 LCD.9
N$4
  Bottom 0.406: R7.P$1 LCD.7
N$5
  Bottom 0.406: R13.P$1 LCD.10
N$6
  Top 0.406: C9.P$2 IC1.2
N$8
  Top 0.406: C5.P$2 25.74,28.76 20.34,23.36 IC1.9
N$9
  Top 0.406: IC1.6 26.69,20.82 27.8,21.93 28.28,21.93 | 28.28,21.93 | 28.28,21.93 C10.P$2
N$11
  Top 0.406: IC3.1 24.04,66.02 23.04,67.02 C11.P$1
N$13
  Top 0.406: IC3.4 31.57,66.02 R8.P$1 R9.P$2
N$14
  Top 0.406: C19.P$1 | C19.P$1 | IC1.3 28.28,17.01 C19.P$1
N$15
  Top 0.406: C20.P$1 | C20.P$1 | IC1.5 27.96,19.55 C20.P$1
N$16
  Bottom 0.406: R17.P$1 LCD.8
N$17
  Top 0.406: R18.P$2 | R18.P$2 | D1.C 38.28,13.04 R18.P$2
N$19
  Top 0.406: R19.P$2 46.69,18.12 46.7,18.12 46.54,17.96 D4.A
N$20
  Top 0.406: C20.P$2 IC1.4
N$21
  Top 0.406: C19.P$2 | C19.P$2 | IC1.1 28.28,14.47 C19.P$2
PGC
  Top 0.406: IC6.27 52.25,30.82 51.3,31.77 ICSP.5
PGD
  Top 0.406: IC6.28 49.24,27.65 47.17,29.71 ICSP.4
REG
  Top 0.406: C2.P$1 55.74,15.74 54.79,16.69 IC6.4 54.79,19.55 51.78,22.57 48.92,22.57 45.9,25.58 45.9,44 45.9,49.71 41.14,54.48 41.14,80.51 42.41,81.78 SV1.6
RF_EN  (via drill 0.5)
  Top 0.406: IC6.6 57.33,19.23 53.05,23.52 49.24,23.52 47.01,25.74 v47.01,27.96 | R15.P$2 44.63,37.49 v44.63,36.7
  Bottom 0.406: v47.01,27.96 47.01,28.76 45.9,29.87 45.9,35.42 v44.63,36.7
RF_EN_OUT
  Top 0.406: R5.P$2 39.55,84.48 38.6,83.53 38.6,81.62 37.33,80.35 SV1.1 37.33,54 44.63,46.7 R15.P$1
RS
  Top 0.406: LCD.4 54.79,9.23 58.6,13.04 58.6,17.49 58.44,17.64 IC6.7 | IC6.7
RW
  Top 0.406: LCD.5 56.06,7.01 56.06,9.07 61.14,14.15 IC6.9
RX
  Top 0.406: RS232.5 24.15,7.01 24.15,9.71 22.57,11.29 22.57,16.69 20.98,18.28 IC1.13
SRESET
  Top 0.406: RS232.6 25.42,9.71 23.52,11.61 23.52,22.73 24.15,23.36 IC1.8
  Bottom 0.406: RS232.6 | RS232.6 | RS232.4 RS232.6 | RS232.6
SW12
  pour Top (rank 3, no thermals): 7.17,68.6 7.17,72.73 25.58,72.73 25.58,70.83 14.79,70.83 12.56,68.6
TA
  Top 0.406: 57.33,35.42 | 57.33,35.42 ENC.1 57.33,35.11 | 57.33,35.42 57.33,36.85 R1.P$1 | 57.33,35.42 | IC6.22 58.6,32.25 57.33,33.52 57.33,35.11 | 57.33,35.11
TB
  Top 0.406: ENC.2 | ENC.2 54.79,36.85 R2.P$1 | ENC.2 | 54.79,35.11 ENC.2 | IC6.23 57.33,30.98 54.79,33.52 54.79,35.11 ENC.2
TC
  Top 0.406: ENC.3 | ENC.3 52.25,36.85 R3.P$1 | ENC.3 | 52.25,35.11 ENC.3 | IC6.25 54.79,30.98 52.25,33.52 52.25,35.11 ENC.3
TD
  Top 0.406: ENC.4 | ENC.4 49.71,36.85 R4.P$1 | ENC.4 | IC6.26 53.52,30.82 49.71,34.63 ENC.4
TIP_DET
  Top 0.406: R5.P$1 44,84.48 44.95,83.53 SV1.8 44.95,81.78 43.68,80.51 43.68,55.9 48.12,51.46 48.12,43.84 51.3,40.66 57.33,40.66 58.13,39.87 58.13,38.28 59.88,36.53 R14.P$1 IC6.21
TX
  Top 0.406: RS232.3 21.61,7.01 21.61,16.38 20.98,17.01 IC1.14
VF  (via drill 0.5)
  Top 0.406: C4.P$1 51.3,15.74 52.25,16.69 IC6.2 52.25,19.39 51.3,20.34 47.97,20.34 40.82,27.49 40.82,43.68 v41.3,44.16 | SV1.4 39.87,81.78 38.6,80.51 38.6,54.16 43.52,49.24 | 43.52,49.24 | v44.95,47.81 43.52,49.24
  Bottom 0.406: v41.3,44.16 v44.95,47.81
VIN
  Top 0.406: 26.25,77.33 C13.P$1
  Top 0.61: C15.P$1 | C15.P$1 | IC3.7 C15.P$1
  Top 1.016: 26.38,74.64 | C15.P$1 26.38,74.64 | 26.38,74.64 26.25,74.76
  Top 1.27: SV1.14 52.57,85.91 50.35,88.13 29.55,88.13 26.25,84.83 26.25,77.33 26.25,74.76
  pour Top (isolate 0.61, rank 4, no thermals): 87.18,60.03 90.99,60.03 90.99,53.36 76.7,53.36 74,50.66 70.67,50.66 70.67,58.44 73.53,61.3 73.53,66.86 71.14,69.24 58.92,69.24 51.78,76.38 51.78,82.73 52.41,83.37 55.27,83.37 56.06,82.57 56.06,78.13 60.19,74 73.21,74 81.3,65.91
VLIM  (via drill 0.5)
  Top 0.406: 42.57,51.62 39.87,54.32 | v41.3,45.59 39.55,43.84 39.55,35.27 37.49,33.2 37.49,27.49 39.55,25.42 39.55,23.52 | 42.57,51.62 | v44.95,49.24 42.57,51.62 | 39.87,54.32 | 39.87,54.32 | 39.87,54.32 SV1.3 | R6.S | R6.S | 39.55,20.68 R16.S 36.22,19.07 34.62,17.47 R16.A | 39.55,20.68 R6.S | R6.S 41.77,20.66 | 39.55,20.68 39.55,20.66 | 39.55,20.68 39.55,23.52 | R6.A 40.17,17.47 40.82,18.12 41.62,18.91 41.77,19.07 R6.S | D5.C 39.55,23.52
  Bottom 0.406: v41.3,45.59 v44.95,49.24
VLIM_OUT
  Top 0.406: IC6.5 56.06,17.17 57.02,16.22 57.02,14.95 56.54,14.47 48.92,14.47 47.49,13.04 46.22,13.04 46.06,12.88 46.06,12.93 D4.C 45.74,12.93 45.74,12.88 45.59,13.04 D1.A
VO
  Top 0.406: R35.S 53.52,7.01 LCD.3
VR
  Top 0.406: C3.P$1 IC6.3 53.52,18.28 53.36,18.44 53.36,19.71 51.78,21.3 48.28,21.3 43.36,26.22 43.36,46.54 36.06,53.84 36.06,81.14 SV1.2

### Text on the board
Top: Top
Bottom: Bottom
tPlace: +12V | GND | GND | +5V
tStop: RF-Gen V0.3 | Supply and Controller | (c) 2012 Christian Klippel